# EAGLE board drive itr2 (EAGLE 6.5.0)
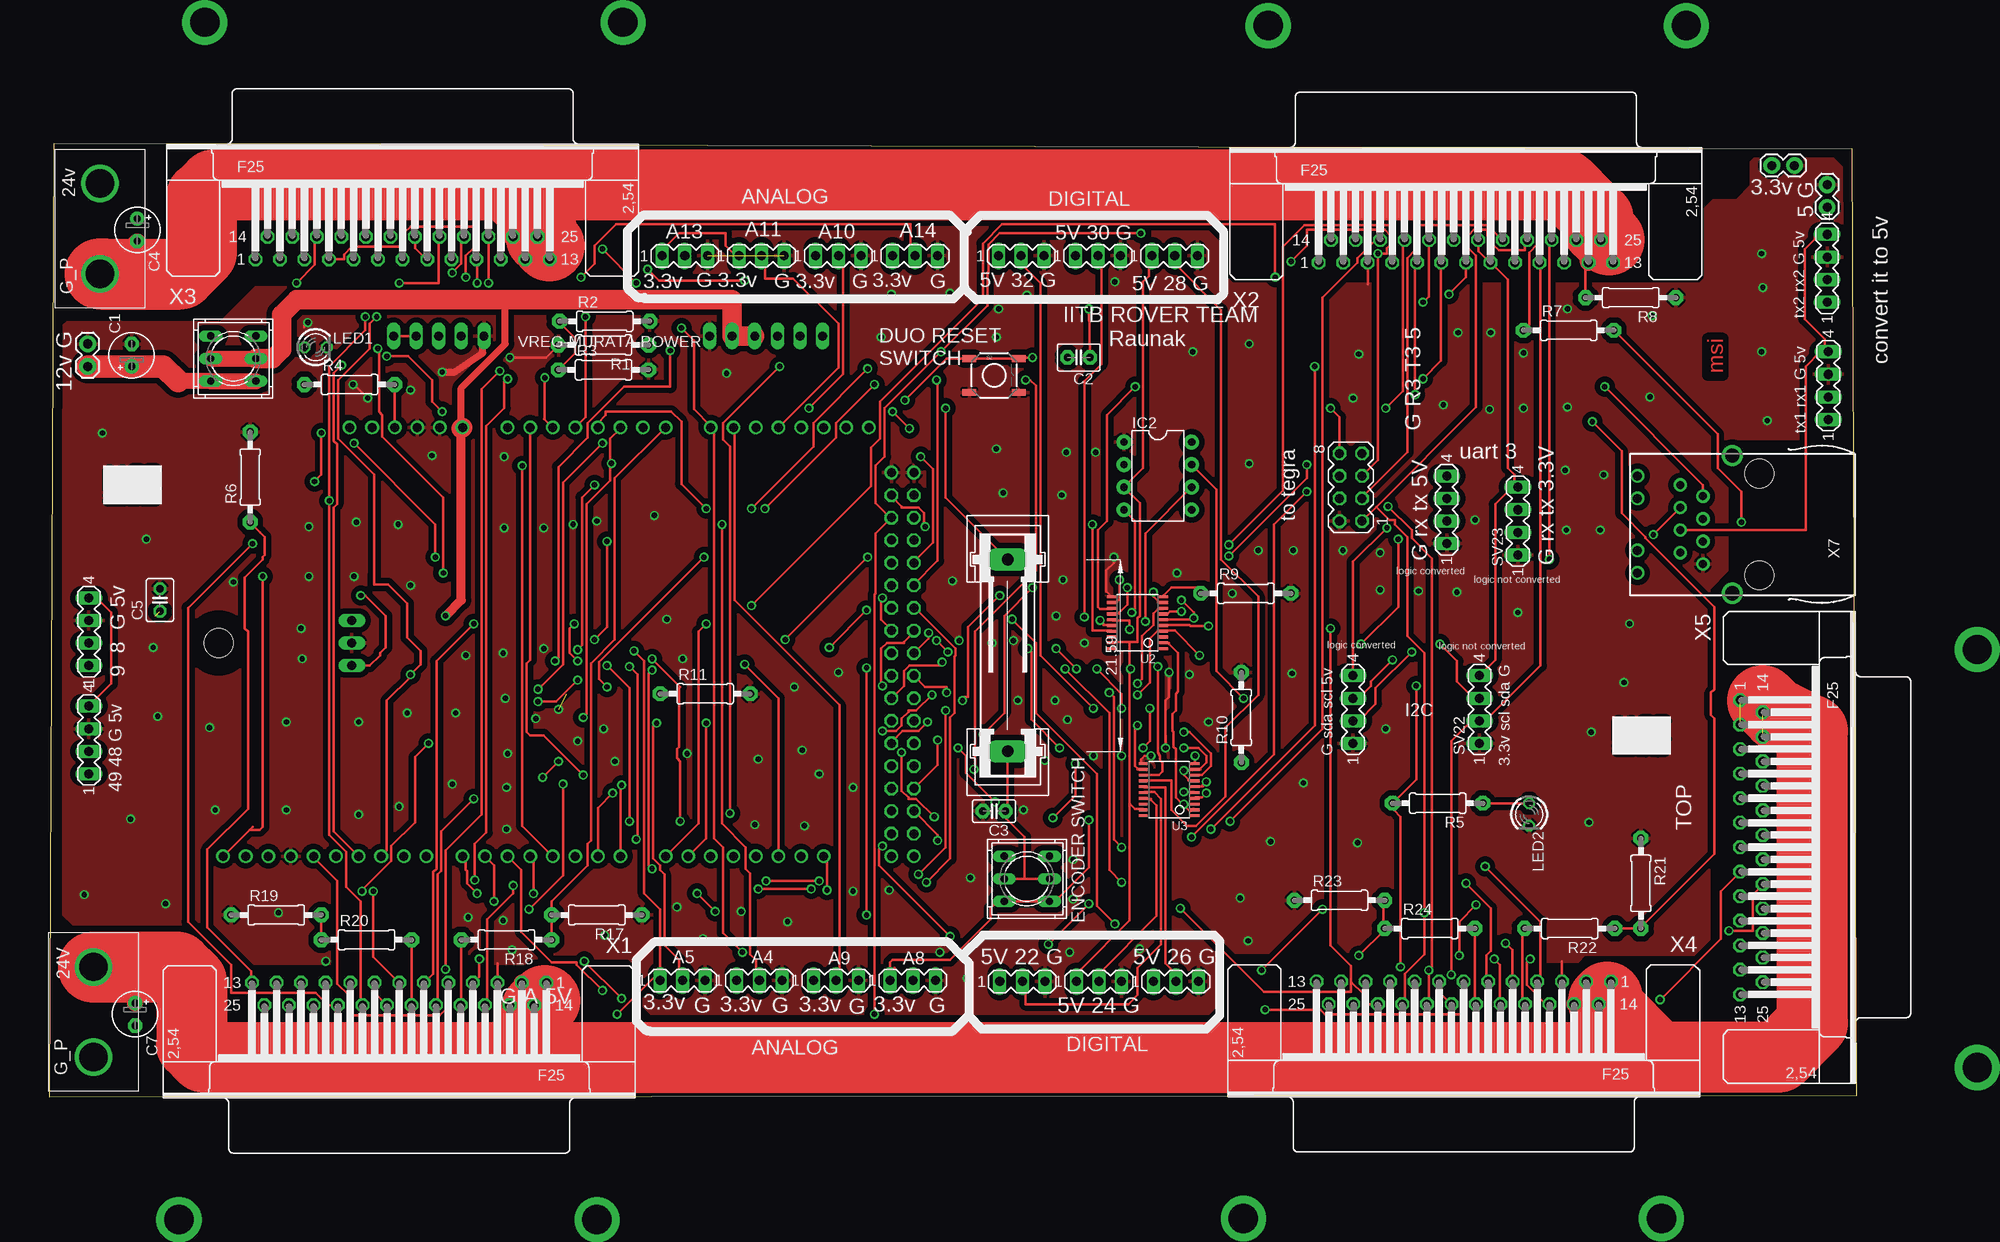
[diagram p2: board, top side]
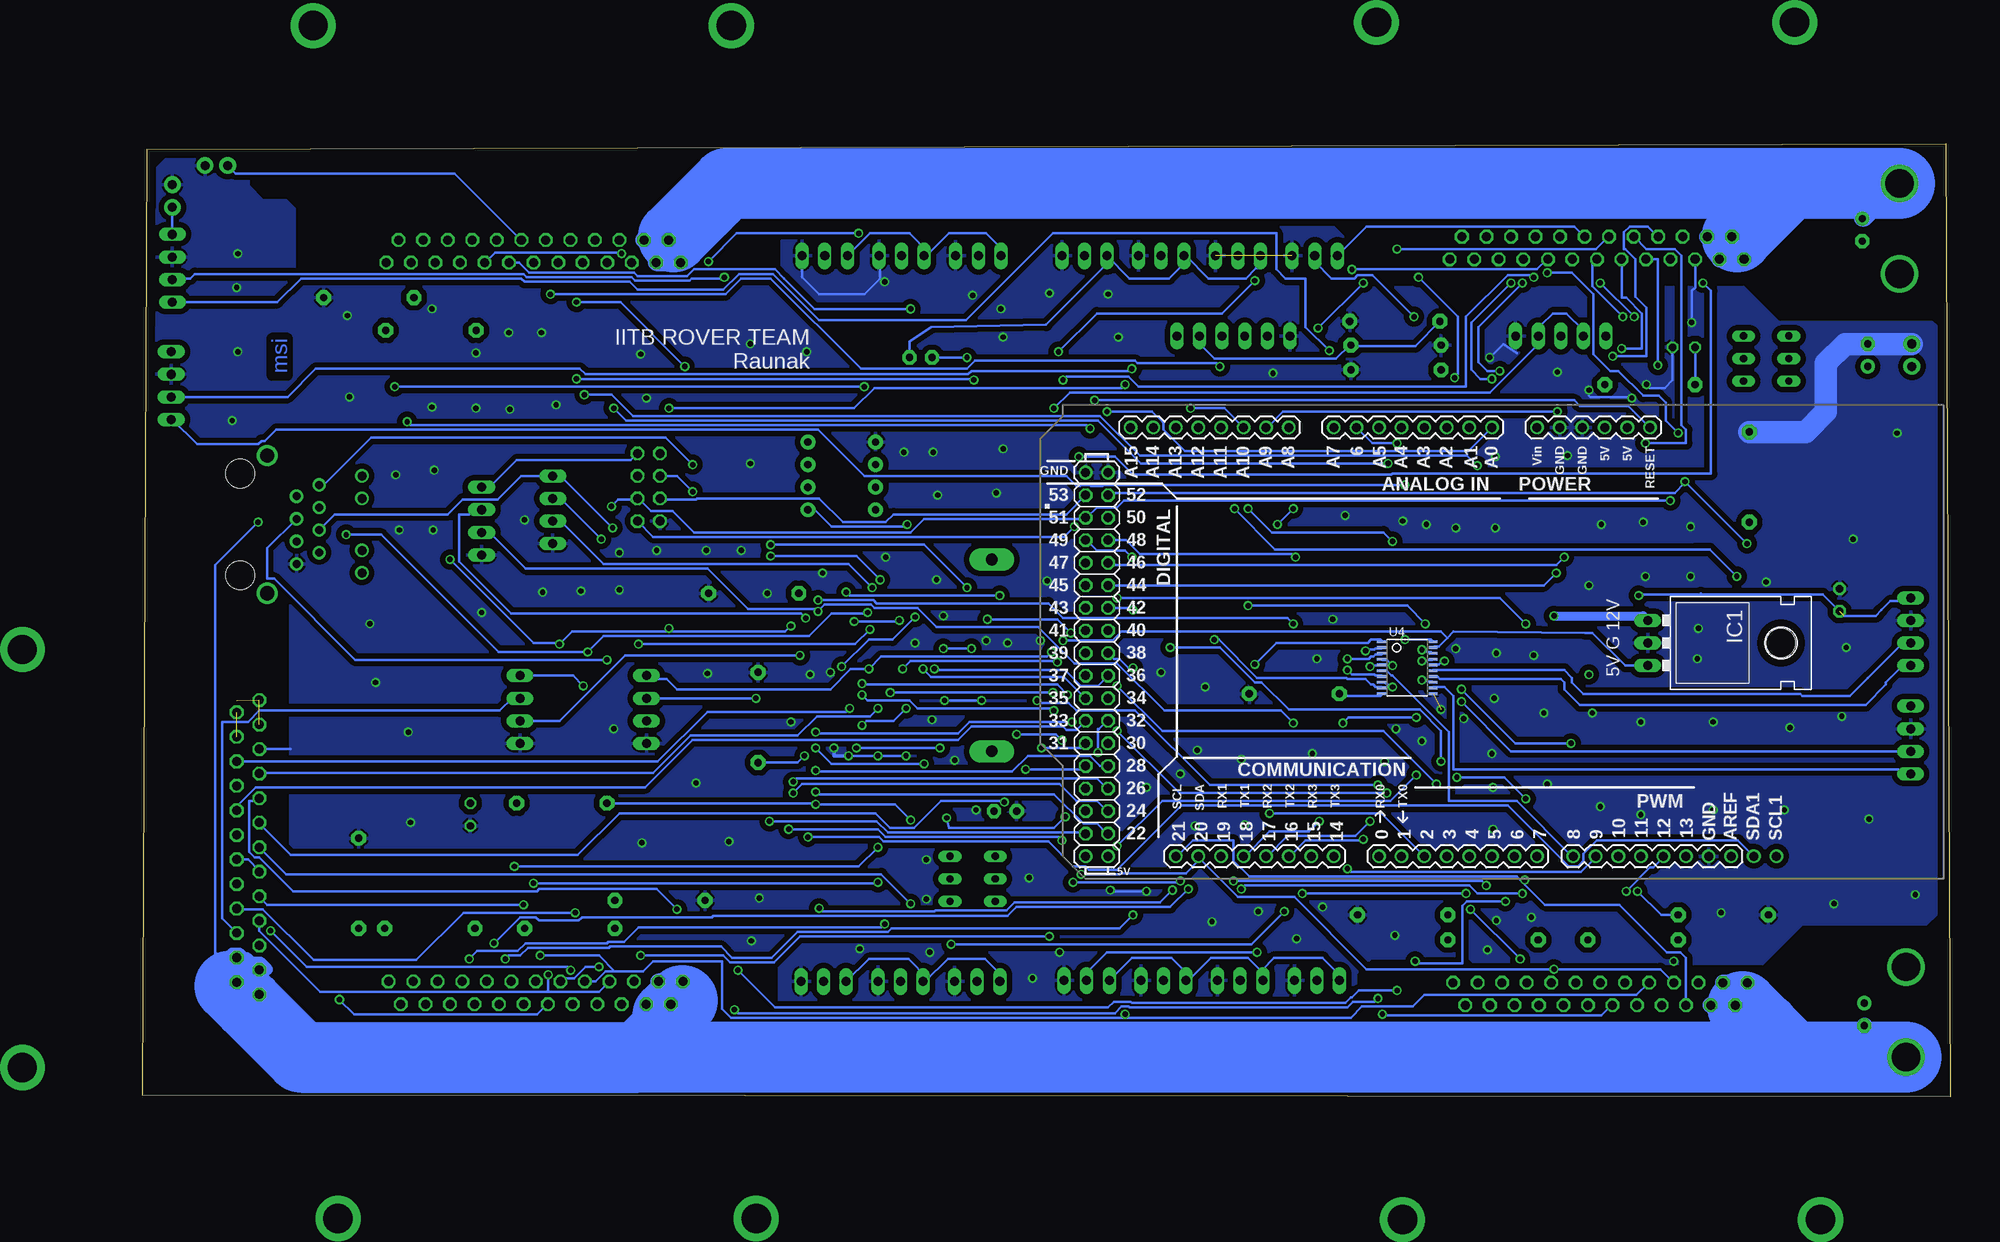
[diagram p3: board, bottom side, seen from below]

Size 203.35 x 107.24 mm. Coordinates in mm from the lower left corner, seen from the top.
Outline: 0,0 203.35,0.13 202.84,106.6 0.51,107.24 0,0
Copper layers (1*16): Top 0.035mm / dielectric 1.5mm / Bottom 0.035mm
Design rules "default": minimum track width 10mil, minimum drill 24mil, track to track 8mil, track to pad 8mil, pad to pad 8mil, via to via 8mil, smd to smd 8mil, copper to edge 40mil, drill to drill 8mil, minimum pad ring 10mil, minimum via ring 8mil, stop-mask expansion 4mil, vias tented up to drill 0mil, thermal gap 10mil

## Footprints (pad centres in the part's own frame; a part is rotated, then mirrored left to right if it is on the bottom)
E2,5-5 = drill 0.813 pad 1.6: + -1.27,0 | drill 0.813 pad 1.6 octagon: - 1.27,0
C2.5-3 = drill 0.813 pad 1.6 octagon: 1 -1.27,0; 2 1.27,0
C2.5-2 = drill 0.813 pad 1.6 octagon: 1 -1.27,0; 2 1.27,0
C025-030X050 = drill 0.813 pad 1.422 octagon: 1 -1.27,0; 2 1.27,0
GSH15 = drill 1.321 pad 2.54 long: 1 -7.62,0; 2 13.97,0
TO-220-ALT = drill 1.016 long: GND 0,-3.81; IN -2.54,-3.81; OUT 2.54,-3.81 | hole 3.302: 0,11.176
DIL08-ROUND = drill 0.813 pad 1.676: 1 -3.81,-3.81; 2 -1.27,-3.81; 3 1.27,-3.81; 4 3.81,-3.81; 5 3.81,3.81; 6 1.27,3.81; 7 -1.27,3.81; 8 -3.81,3.81
1X02 = drill 1.016 pad 1.88: 1 0,0; 2 2.54,0
LED3MM = drill 0.813 octagon: A -1.27,0; K 1.27,0
0207/10 = drill 0.813 pad 1.676 octagon: 1 -5.08,0; 2 5.08,0
TACTILE-SWITCH-SMD = smd 1.524 x 0.762: 1 -2.794,1.905; 2 2.794,1.905; 3 -2.794,-1.905; 4 2.794,-1.905
9077-2 = drill 0.813 long: 1 -2.54,2.54; 2 0,2.54; 3 2.54,2.54; 4 -2.54,-2.54; 5 0,-2.54; 6 2.54,-2.54
MA04-1 = drill 1.016 long: 1 -3.81,0; 2 -1.27,0; 3 1.27,0; 4 3.81,0
MA03-1 = drill 1.016 long: 1 -2.54,0; 2 0,0; 3 2.54,0
MA04-2 = drill 1.016 octagon: 1 -3.81,-1.27; 2 -3.81,1.27; 3 -1.27,-1.27; 4 -1.27,1.27; 5 1.27,-1.27; 6 1.27,1.27; 7 3.81,-1.27; 8 3.81,1.27
ARDUINO_MEGA = drill 1.016 pad 1.422: 0 63.5,50.8; 1 60.96,50.8; 2 58.42,50.8; 3 55.88,50.8; 3.3V 35.56,2.54; 4 53.34,50.8; 5 50.8,50.8; 5V@0 38.1,2.54; 5V@1 93.98,50.8; 5V@2 96.52,50.8; 6 48.26,50.8; 7 45.72,50.8; 8 41.656,50.8; 9 39.116,50.8; 10 36.576,50.8; 11 34.036,50.8; 12 31.496,50.8; 13 28.956,50.8; 14 68.58,50.8; 15 71.12,50.8; 16 73.66,50.8; 17 76.2,50.8; 18 78.74,50.8; 19 81.28,50.8; 20 83.82,50.8; 21 86.36,50.8; A0 50.8,2.54; A1 53.34,2.54; A2 55.88,2.54; A3 58.42,2.54; A4 60.96,2.54; A5 63.5,2.54; A6 66.04,2.54; A7 68.58,2.54; A8 73.66,2.54; A9 76.2,2.54; A10 78.74,2.54; A11 81.28,2.54; A12 83.82,2.54; A13 86.36,2.54; A14 88.9,2.54; A15 91.44,2.54; AREF 23.876,50.8; GND@0 40.64,2.54; GND@1 43.18,2.54; GND@2 93.98,7.62; GND@3 96.52,7.62; GND@4 26.416,50.8; RESET 33.02,2.54; SCL1 18.796,50.8; SDA1 21.336,50.8; VIN 45.72,2.54 | drill 1.016 pad 1.422 octagon: 22 93.98,48.26; 23 96.52,48.26; 24 93.98,45.72; 25 96.52,45.72; 26 93.98,43.18; 27 96.52,43.18; 28 93.98,40.64; 29 96.52,40.64; 30 93.98,38.1; 31 96.52,38.1; 32 93.98,35.56; 33 96.52,35.56; 34 93.98,33.02; 35 96.52,33.02; 36 93.98,30.48; 37 96.52,30.48; 38 93.98,27.94; 39 96.52,27.94; 40 93.98,25.4; 41 96.52,25.4; 42 93.98,22.86; 43 96.52,22.86; 44 93.98,20.32; 45 96.52,20.32; 46 93.98,17.78; 47 96.52,17.78; 48 93.98,15.24; 49 96.52,15.24; 50 93.98,12.7; 51 96.52,12.7; 52 93.98,10.16; 53 96.52,10.16
TSSOP20 = smd 0.305 x 0.991: 1 -2.925,-2.918; 2 -2.275,-2.918; 3 -1.625,-2.918; 4 -0.975,-2.918; 5 -0.325,-2.918; 6 0.325,-2.918; 7 0.975,-2.918; 8 1.625,-2.918; 9 2.275,-2.918; 10 2.925,-2.918; 11 2.925,2.918; 12 2.275,2.918; 13 1.625,2.918; 14 0.975,2.918; 15 0.325,2.918; 16 -0.325,2.918; 17 -0.975,2.918; 18 -1.625,2.918; 19 -2.275,2.918; 20 -2.925,2.918
VREG = drill 1 long: P$1 0,0; P$2 2.54,0; P$3 5.08,0; P$4 7.62,0; P$5 10.16,0; P$6 35.56,0; P$7 38.1,0; P$8 40.64,0; P$9 43.18,0; P$10 45.72,0; P$11 48.26,0
POW_HOLE = drill 3.2: P$1 0,0; P$2 10.16,0
F25HP = drill 1.016 octagon: 1 -16.561,-1.27; 2 -13.792,-1.27; 3 -11.049,-1.27; 4 -8.28,-1.27; 5 -5.512,-1.27; 6 -2.769,-1.27; 7 0,-1.27; 8 2.769,-1.27; 9 5.512,-1.27; 10 8.28,-1.27; 11 11.049,-1.27; 12 13.792,-1.27; 13 16.561,-1.27; 14 -15.189,1.27; 15 -12.421,1.27; 16 -9.652,1.27; 17 -6.909,1.27; 18 -4.14,1.27; 19 -1.372,1.27; 20 1.372,1.27; 21 4.14,1.27; 22 6.909,1.27; 23 9.652,1.27; 24 12.421,1.27; 25 15.189,1.27 | drill 3.302 pad 5.08: G1 -22.25,25.4; G2 24.79,25.4
SI-50170 = drill 0.9 pad 1.5: 1 4.445,5.842; 2 3.175,3.302; 3 1.905,5.842; 4 0.635,3.302; 5 -0.635,5.842; 6 -1.905,3.302; 7 -3.175,5.842; 8 -4.445,3.302 | drill 1.016 pad 1.5: A1 -5.461,10.668; A2 2.921,10.668; C1 -2.921,10.668; C2 5.461,10.668 | drill 1.6 pad 2.2: S1 -7.747,0; S2 7.747,0 | hole 3.251: -5.715,-3.048; 5.715,-3.048

## Placement (x,y rotation side)
C1  [E2,5-5]  9.27,83.44 90 top
C2  [C2.5-3]  115.82,83.19 180 top
C3  [C2.5-2]  106.3,32.13 180 top
C4  [E2,5-5]  9.91,97.54 270 top
C5  [C025-030X050]  12.45,55.88 90 top
C7  [E2,5-5]  9.65,9.27 270 top
F3  FUSEGSH15  [GSH15]  107.82,46.48 90 top
IC1  [TO-220-ALT]  30.23,51.05 270 bottom
IC2  NE555N  [DIL08-ROUND]  124.71,69.85 270 top
JP1  M02PTH  [1X02]  4.32,82.17 90 top
JP2  M02PTH  [1X02]  193.8,104.78 0 top
JP3  M02PTH  [1X02]  200.02,100.08 90 top
LED1  [LED3MM]  29.97,84.33 0 top
LED2  [LED3MM]  166.5,31.75 270 top
R1  [0207/10]  62.36,84.58 180 top
R2  [0207/10]  62.48,87.25 0 top
R3  [0207/10]  62.36,81.79 0 top
R4  [0207/10]  33.78,80.14 0 top
R5  [0207/10]  156.21,33.02 180 top
R6  [0207/10]  22.61,69.72 90 top
R7  [0207/10]  170.94,86.23 0 top
R8  [0207/10]  177.93,89.92 180 top
R9  [0207/10]  134.62,56.64 0 top
R10  [0207/10]  134.11,42.67 90 top
R11  [0207/10]  73.79,45.34 0 top
R17  [0207/10]  61.59,20.45 180 top
R18  [0207/10]  51.43,17.65 180 top
R19  [0207/10]  25.53,20.45 0 top
R20  [0207/10]  35.69,17.65 0 top
R21  [0207/10]  179.07,24 270 top
R22  [0207/10]  171.07,18.92 180 top
R23  [0207/10]  145.16,22.1 0 top
R24  [0207/10]  155.32,18.92 0 top
S2  [TACTILE-SWITCH-SMD]  106.3,81.15 0 top
S5  9077-2  [9077-2]  109.98,24.51 90 top
S6  9077-2  [9077-2]  20.7,83.06 90 top
SV1  [MA04-1]  157.23,66.04 90 top
SV2  [MA03-1]  71.5,94.61 0 top
SV3  [MA03-1]  97.41,94.61 0 top
SV4  [MA03-1]  109.35,94.61 0 top
SV5  [MA03-1]  117.98,94.61 0 top
SV6  [MA03-1]  126.62,94.61 0 top
SV7  [MA03-1]  126.75,12.95 0 top
SV8  [MA03-1]  109.47,12.95 0 top
SV9  [MA03-1]  118.11,12.95 0 top
SV10  [MA04-1]  200.02,93.22 90 top
SV11  [MA04-1]  200.15,80.01 90 top
SV12  [MA04-1]  4.45,52.32 90 top
SV13  [MA03-1]  80.14,94.61 0 top
SV14  [MA04-1]  146.69,43.56 90 top
SV15  [MA04-1]  4.45,40.13 90 top
SV16  [MA04-2]  146.43,68.58 90 top
SV17  [MA03-1]  71.25,13.08 0 top
SV18  [MA03-1]  79.88,13.08 0 top
SV19  [MA03-1]  88.77,94.61 0 top
SV20  [MA03-1]  88.52,13.08 0 top
SV21  [MA03-1]  97.16,13.08 0 top
SV22  [MA04-1]  160.91,43.56 90 top
SV23  [MA04-1]  165.23,64.77 90 top
U1  ARDUINO-MEGAFULL  [ARDUINO_MEGA]  0.76,77.85 180 bottom
U2  [TSSOP20]  122.43,53.34 90 top
U3  [TSSOP20]  125.98,34.54 90 top
U4  [TSSOP20]  61.09,48.26 270 bottom
U$1  [MSI]  175.89,39.12 0 top
U$2  [MSI]  6.1,67.31 0 top
U$7  VREG-MURATA  [VREG]  38.73,85.6 0 top
U$8  POW_HOLE  [POW_HOLE]  4.95,4.45 90 top
U$9  POW_HOLE  [POW_HOLE]  5.71,92.58 90 top
X1  [F25HP]  39.37,11.56 180 top
X2  [F25HP]  159.38,95.12 0 top
X3  [F25HP]  39.75,95.5 0 top
X4  [F25HP]  159.13,11.68 180 top
X5  [F25HP]  191.52,28.07 270 top
X7  SI-50170  [SI-50170]  189.36,64.39 90 top

## Tracks (layer width: path | path; a pad name or v marks a point on that pad's centre or on a via)
1DB1  (via drill 0.61)
  Top 0.254: U1.27 99.95,37.34 v99.95,40.13 | v105.03,40.77 107.44,43.18 107.44,54.1 v110.62,57.28 | v132.72,62.1 138.81,68.2 138.81,95.63 141.22,98.04 151.38,98.04 151.38,94.11 151.13,93.85 X2.4
  Bottom 0.254: v99.95,40.13 100.58,40.77 v105.03,40.77 | v110.62,57.28 115.44,62.1 v132.72,62.1
1DB2  (via drill 0.61)
  Top 0.254: v132.84,30.99 143.26,41.4 143.26,89.92 147.19,93.85 147.19,94.36 149.22,96.39 X2.16
  Bottom 0.254: U1.23 97.41,29.72 119.51,29.72 120.78,30.99 v132.84,30.99
1DT1  (via drill 0.61)
  Top 0.254: v104.01,36.83 104.14,36.96 104.14,52.32 111,59.18 111,80.01 110.36,80.64 v109.86,80.64 | v154.56,80.77 156.59,82.8 156.59,93.85 X2.6
  Bottom 0.254: U1.29 97.66,36.83 v104.01,36.83 | v109.86,80.64 109.98,80.77 v154.56,80.77
1DT2  (via drill 0.61)
  Top 0.254: U1.25 99.95,29.46 v99.95,28.83 | v130.68,30.1 142.37,41.78 v142.37,82.17 | v154.56,89.41 155.19,90.04 155.19,96.39 X2.18
  Bottom 0.254: v99.95,28.83 100.33,29.21 119.76,29.21 120.65,30.1 v130.68,30.1 | v142.37,82.17 149.61,89.41 v154.56,89.41
3DB1  (via drill 0.61)
  Top 0.254: X3.4 33.15,94.23 33.15,94.74 34.04,95.63 40,95.63 40,97.28 40.64,97.92 47.75,97.92 47.75,95.5 46.86,94.61 v46.86,92.2 | v99.82,80.64 99.95,80.52 99.95,60.33 97.28,57.66 U1.45
  Bottom 0.254: v46.86,92.2 47.12,92.46 49.78,92.46 54.48,87.76 54.48,79.88 91.31,79.88 92.46,81.03 99.44,81.03 v99.82,80.64
3DB2  (via drill 0.61)
  Top 0.254: X3.16 29.85,96.52 29.85,93.6 v27.81,91.57 | v98.04,72.01 99.44,70.61 99.44,62.36 97.28,60.2 U1.47
  Bottom 0.254: v27.81,91.57 26.92,90.68 26.92,70.1 62.74,70.1 62.86,69.98 91.95,69.98 93.98,72.01 v98.04,72.01
3DT1  (via drill 0.61)
  Top 0.254: v36.96,84.2 37.08,84.07 37.08,77.09 37.46,76.71 37.46,74.3 44.32,67.44 v44.32,58.93
  Bottom 0.254: v36.96,84.2 34.67,84.2 34.67,88.14 36.45,89.92 36.96,89.92 36.96,94.23 X3.6 | v44.32,58.93 45.72,57.53 U1.44
3DT2  (via drill 0.61)
  Top 0.254: v34.29,73.53 43.43,64.39 v43.43,60.71
  Bottom 0.254: v34.29,73.53 29.72,73.53 29.72,75.06 30.23,75.56 30.23,94.61 30.99,95.38 34.16,95.38 35.56,96.77 X3.18 | v43.43,60.71 44.32,59.82 94.49,59.82 U1.46
4DB1  (via drill 0.61)
  Top 0.254: v48.39,15.49 48.39,13.46 47.75,12.83 X1.4 | v53.97,21.08 57.78,24.89 v57.78,35.18 | v93.73,46.23 93.6,46.35 93.6,50.42 94.23,51.05 96.14,51.05 96.14,51.18 97.28,52.32 U1.41
  Bottom 0.254: v53.97,21.08 v48.39,15.49 | v57.78,35.18 63.75,41.15 88.65,41.15 v93.73,46.23
4DB2  (via drill 0.61)
  Top 0.254: X1.16 49.28,10.54 49.28,19.94 52.2,22.86 v52.2,23.75 | v86.61,24.26 v80.65,24.26 | v98.68,24.13 101.35,26.8 101.35,42.67 101.85,43.18 101.85,49.53 101.98,49.66 101.98,50.42 97.41,54.99 U1.43
  Bottom 0.254: v52.2,23.75 52.7,24.26 v80.65,24.26 | v86.61,24.26 86.74,24.13 v98.68,24.13
4DT1  (via drill 0.61)
  Top 0.254: v47.75,53.21 43.56,49.02 43.56,25.65 43.18,25.27 43.18,13.84 42.16,12.83 X1.6 | v93.73,56.13 93.6,56.01 93.6,53.72 94.74,52.58 U1.40
  Bottom 0.254: v47.75,53.21 50.67,56.13 v93.73,56.13
4DT2  (via drill 0.61)
  Top 0.254: v47.75,33.53 44.07,29.84 44.07,25.4 43.69,25.02 43.69,10.41 43.56,10.29 X1.18 | v57.28,37.72 v55.5,35.94 | v91.95,54.74 v87.76,50.55
  Bottom 0.254: v47.75,33.53 50.16,35.94 v55.5,35.94 | v57.28,37.72 57.28,41.15 59.69,43.56 74.42,43.56 77.47,46.61 78.23,46.61 82.17,50.55 v87.76,50.55 | v91.95,54.74 92.2,54.99 U1.42
5DB1  (via drill 0.61)
  Top 0.254: U1.37 98.55,46.1 100.97,46.1 v100.97,45.47 | v119.25,45.47 119.76,44.96 119.76,28.96 v120.65,28.07 | v161.54,25.91 167.77,19.68 167.77,13.21 167.51,12.95 X4.4
  Bottom 0.254: v119.25,45.47 v100.97,45.47 | v120.65,28.07 122.81,25.91 v161.54,25.91
5DB2  (via drill 0.61)
  Top 0.254: U1.39 98.93,51.56 v98.93,52.2 | v108.33,53.72 111,51.05 111,43.18 117.86,36.32 117.86,21.46 v119.89,19.43 | v166.62,15.49 166.24,15.11 166.24,12.57 168.4,10.41 X4.16
  Bottom 0.254: v98.93,52.2 100.46,53.72 v108.33,53.72 | v119.89,19.43 120.27,19.05 147.57,19.05 149.22,17.4 151,17.4 151.13,17.27 160.27,17.27 161.16,16.38 165.73,16.38 v166.62,15.49
5DT1  (via drill 0.61)
  Top 0.254: v114.3,48.13 119.25,43.18 119.25,25.53 v120.65,24.13 | v159.38,24 162.18,21.21 162.18,16.38 161.67,15.88 161.67,13.08 161.8,12.95 X4.6
  Bottom 0.254: U1.36 95.89,46.23 97.79,46.23 99.57,48.01 114.17,48.01 v114.3,48.13 | v120.65,24.13 120.78,24 v159.38,24
5DT2  (via drill 0.61)
  Top 0.254: v91.95,20.45 v91.95,48.26 | v162.56,15.49 163.19,14.86 163.19,10.41 X4.18
  Bottom 0.254: U1.38 94.11,49.28 93.47,49.28 92.46,48.26 v91.95,48.26 | v91.95,20.45 93.47,18.92 119.13,18.92 119.51,18.54 129.67,18.54 132.59,15.62 137.03,15.62 138.3,16.89 150.75,16.89 150.88,16.76 160.02,16.76 160.91,15.88 162.18,15.88 v162.56,15.49
5V_NEW  (via drill 0.6, 0.61)  (1 unrouted)
  Top 0.254: SV15.4 6.99,46.48 6.99,54.48 5.33,56.13 SV12.4 | X7.5 197.61,63.75 197.61,82.17 199.26,83.82 199.77,83.82 | SV10.4 198.63,97.03 198.63,96.52 197.48,95.38 197.48,87.5 199.77,85.22 199.77,83.82 | 199.77,83.82 SV11.4 | SV14.4 146.69,60.2 v150.49,64.01 | 121.54,51.18 122.43,51.18 122.43,53.85 122.68,54.1 122.68,66.8 121.03,68.45 121.03,68.58 | 121.54,51.18 119.63,51.18 U2.19 | 121.6,32.96 121.54,33.02 121.54,48.13 | 121.6,32.96 122.17,32.38 123.06,32.38 U3.19 | 121.54,51.18 121.54,48.13 | SV9.1 116.08,13.46 116.08,14.35 121.54,19.81 121.54,32.89 121.6,32.96 | SV6.1 123.7,94.23 123.7,92.33 123.06,91.69 123.06,70.74 121.03,68.71 121.03,68.58 | 121.54,48.13 v121.67,48.13 | v101.09,50.04 v99.82,51.31 | 121.03,68.58 IC2.3
  Top 0.305: v35.05,56.39 35.56,56.39 37.85,54.1 37.85,50.55 37.21,49.91 37.21,49.66 36.07,48.51 IC1.OUT
  Bottom 0.254: 56.58,51.63 55.88,52.32 41.02,52.2 | 56.58,51.63 57.53,50.67 58.04,50.67 58.17,50.55 U4.19 | SV12.4 4.83,55.75 6.73,55.75 7.75,54.74 | JP3.1 SV10.4 | v150.49,64.01 156.34,69.85 SV1.4 160.78,69.85 163.45,67.18 167.39,67.18 169.04,65.53 181.74,65.53 X7.5 | SV4.1 106.81,95.89 107.19,95.89 108.46,97.16 112.65,97.16 115.19,94.61 SV5.1 114.94,95 117.09,97.16 121.54,97.16 SV6.1 | SV8.1 106.93,14.22 107.31,14.22 108.59,15.49 112.78,15.49 115.32,12.95 SV9.1 115.06,13.34 117.22,15.49 121.67,15.49 SV7.1 | SV14.4 146.3,46.99 144.4,46.99 143.26,45.85 125.98,45.85 123.7,48.13 v121.67,48.13 120.27,49.53 101.6,49.53 v101.09,50.04 | 56.58,51.63 57.28,52.32 93.22,52.32 94.23,51.31 v99.82,51.31
  Bottom 0.305: 7.75,54.74 8.38,54.1 11.94,54.1 14.35,56.52 27.94,56.52 | 27.94,56.52 28.07,56.64 | 41.02,52.2 40.26,52.2 36.58,48.51 IC1.OUT | 27.94,56.52 34.92,56.52 v35.05,56.39
6DB1  (via drill 0.61)
  Top 0.254: U1.34 96.14,46.23 96.14,47.88 96.77,48.51 100.46,48.51 v100.46,48.9 | v117.86,48.13 120.65,45.34 v120.65,43.69
  Bottom 0.254: v100.46,48.9 100.58,49.02 116.97,49.02 v117.86,48.13 | v120.65,43.69 121.54,42.8 127.51,42.8 129.67,40.64 141.73,40.64 145.92,36.45 190.25,36.45 X5.4
6DB2  (via drill 0.61)
  Top 0.254: v113.28,50.42 v115.57,48.13 | v110.11,50.42 110.49,50.04 110.49,42.42 v113.67,39.24 | v123.06,39.24 123.83,40.01 v123.83,43.69
  Bottom 0.254: U1.35 99.7,47.24 114.68,47.24 v115.57,48.13 | v110.11,50.42 v113.28,50.42 | v123.06,39.24 v113.67,39.24 | v123.83,43.69 124.21,43.31 139.83,43.31 145.41,37.72 X5.16
6DT1  (via drill 0.61)
  Top 0.254: v102.23,39.24 103.12,38.35 103.12,36.45 v106.43,33.15
  Bottom 0.254: U1.31 97.79,39.24 v102.23,39.24 | v106.43,33.15 106.55,33.27 113.54,33.27 116.59,30.23 119.25,30.23 120.9,31.88 149.73,31.88 154.43,27.18 186.69,27.18 190.25,30.73 X5.6
6DT2
  Bottom 0.254: U1.33 98.3,41.27 99.44,41.27 99.82,41.66 110.11,41.66 111.63,40.13 141.48,40.13 146.81,34.8 190.63,34.8 192.79,32.64 X5.18
12V
  Top 1.778: S6.4 S6.1 14.48,80.52
  Top 2.54: JP1.1 C1.+ 12.83,82.17 14.48,80.52
24V_A
  Bottom 0.254: 142.88,93.85 143.64,96.77
  Bottom 1.778: 23.11,94.23 X3.1 X3.2 25.96,95.4 X3.15 X3.14 24,96.77 | C4.+ 9.65,98.81 U$9.P$2
  Bottom 1.93: 143.64,96.77 146.58,96.77 X2.15 | X2.2 142.88,93.85 X2.1 142.82,95.02 X2.14
  Bottom 8: 143.64,96.77 137.67,102.74 U$9.P$2 18.03,102.74 24,96.77
24V_B  (3 unrouted)
  Top 0.254: X5.14 192.79,43.31 194.94,42.8 | 53.34,6.1 54.86,9.53 X1.14
  Top 1.778: X4.15 X4.14 | X4.14 174.5,10.41 174.94,10.86 | X4.2 175.01,12.95 175.51,12.45 175.51,12.78 X4.1 175.69,11.79 X4.14 | X1.2 X1.1 54.86,11.76 54.86,9.91 | X1.14 X1.15 | C7.+ 9.65,13.59 8.64,14.61
  Top 8: U$8.P$2 8.64,14.61 14.35,14.61 16,12.95 16,5.84 17.4,4.45 51.69,4.45 | 51.69,4.45 180.97,4.45 | 192.79,44.58 194.44,42.93 194.94,42.8 198.37,41.15 198.37,8.26 194.56,4.45 180.97,4.45 | 51.69,4.45 53.34,6.1 53.34,6.35 54.86,7.87 54.86,9.53 54.86,9.91 55.75,10.79 | 180.97,4.45 174.88,10.54 174.88,10.79 174.94,10.86 175.26,11.18
AB1  (via drill 0.61)
  Top 0.254: SV17.2 70.87,13.46 70.87,15.37 69.22,17.02 69.22,25.02 68.71,25.53 68.71,26.04 67.95,26.8 67.95,41.66 v68.33,42.04 | v60.07,42.67 60.45,43.05 60.45,66.67 63.12,69.34 63.12,71.25 | 63.12,71.25 63.12,74.04 64.26,75.18 U1.A5 | v150.37,77.47 152.27,79.38 152.27,96.27 152.4,96.39 X2.17 | 63.12,71.25 v63.25,71.25
  Bottom 0.254: v68.33,42.04 67.69,42.67 v60.07,42.67 | v150.37,77.47 148.97,76.07 95.89,76.07 91.06,71.25 v63.25,71.25
AB2  (via drill 0.61)
  Top 0.254: v85.47,77.47 89.28,81.28 89.28,93.22 88.77,93.73 SV19.2
  Bottom 0.254: U1.A10 81.66,77.47 v85.47,77.47
AB3  (via drill 0.61)
  Top 0.254: SV20.2 88.9,13.46 88.9,44.07 77.09,55.88 77.09,74.55 76.96,74.68 U1.A9
  Top 0.305: v37.97,83.31 40.39,83.31 43.05,80.64 43.05,78.23 v44.2,77.09
  Bottom 0.254: v37.97,83.31 34.16,83.31 34.16,88.77 35.43,90.04 35.43,94.23 36.58,95.38 36.7,95.38 36.7,97.28 36.07,97.92 34.04,97.92 32.89,96.77 X3.17 | v44.2,77.09 75.06,77.09 76.84,75.31 U1.A9
AB4
  Top 0.254: U1.A7 63.63,69.6 63.63,51.44 60.96,48.77 60.96,28.83 60.58,28.45 60.58,26.04 56.52,21.97 R17.2 R18.1
AB5  (via drill 0.61)
  Top 0.254: v96.77,75.18 v94.87,77.09 | v173.61,75.95 176.91,72.64 176.91,65.66 179.58,62.99 179.58,62.87 187.32,55.12 187.32,45.85 186.94,45.47 186.94,42.93 187.32,42.55 187.32,27.3 179.07,19.05 R21.2 R22.1
  Bottom 0.254: U1.A0 54.23,72.64 86.11,72.64 88.52,75.06 88.52,75.95 88.65,75.95 89.79,77.09 v94.87,77.09 | v96.77,75.18 97.16,75.56 173.23,75.56 v173.61,75.95
AB6  (via drill 0.6, 0.61)
  Top 0.254: U1.A2 55.69,76.26 55.75,76.33 v55.75,80.9 | v59.82,92.2 61.34,93.73 61.34,95.76 63.75,98.17 96.9,98.17 96.9,96.01 97.41,95.5 SV3.2
  Bottom 0.254: v59.82,92.2 55.37,87.76 55.37,81.28 v55.75,80.9
AT1  (via drill 0.61)
  Top 0.254: SV18.2 79.5,13.46 79.5,15.37 78.87,16 78.87,25.15 78.36,25.65 78.36,28.07 75.69,30.73 v75.69,64.39 | v73.91,66.17 71.12,68.96 71.12,75.95 69.98,77.09 62.61,77.09 62.61,76.71 61.72,75.82 U1.A4
  Bottom 0.254: v73.91,66.17 v75.69,64.39
AT3  (via drill 0.61)
  Top 0.254: v77.98,16.26 75.82,18.41 75.82,28.07 74.8,29.08 74.8,74.55 74.42,74.93 U1.A8 74.42,75.44 72.52,77.34 72.52,85.09 v71.12,86.49 | v66.04,91.57 v62.23,95.38
  Bottom 0.254: SV21.2 97.16,14.35 96.77,14.35 94.87,16.26 v77.98,16.26 | v62.23,95.38 39.88,95.38 38.48,96.77 X3.19 | v71.12,86.49 v66.04,91.57
AT4  (via drill 0.61)
  Top 0.254: v62.23,73.53 57.78,69.09 57.78,48.64 v54.99,45.85 | v42.67,39.75 41.15,38.23 41.15,30.86 38.48,28.19 38.48,26.54 35.18,23.24 v35.18,23.11 | R19.2 R20.1
  Bottom 0.254: U1.A6 65.02,73.53 v62.23,73.53 | v54.99,45.85 48.89,39.75 v42.67,39.75 | v35.18,23.11 32.51,20.45 R19.2
AT5  (via drill 0.61)
  Top 0.254: v93.73,28.19 93.34,27.81 93.34,26.04 v101.35,18.03 | v147.32,15.88 150.24,18.8 R24.1 150.11,18.8 150.11,21.97 R23.2
  Top 0.305: v60.07,36.2 55.63,40.64 54.1,40.64 53.72,41.02 53.72,48.77 54.1,49.15 U1.A1
  Bottom 0.254: v60.07,36.2 62.99,33.27 88.65,33.27 v93.73,28.19 | v101.35,18.03 129.41,18.03 132.33,15.11 137.29,15.11 138.05,15.88 v147.32,15.88
AT6  (via drill 0.61)
  Top 0.254: U1.A3 60.32,76.45 v60.32,87.76
  Bottom 0.254: v60.32,87.76 65.02,92.46 66.68,92.46 67.06,92.08 69.6,92.08 71.5,93.98 SV2.2
CONN
  Top 0.254: S5.5 109.73,24.51 | 109.73,24.51 S5.2 | F3.1 107.82,32.38 C3.1 107.7,32.13 107.7,31.24 109.73,29.21 109.73,24.51
CUR_SENS
  Top 0.254: U1.A11 88.77,82.04 88.77,87 83.69,92.08 80.52,92.08 80.52,94.23 SV13.2
D48  (via drill 0.61)
  Top 0.254: v62.74,46.1 61.85,46.99 61.85,48.9 v73.66,60.71
  Bottom 0.254: v62.74,46.1 62.86,46.23 63.12,46.23 63.37,46.48 63.5,46.48 63.63,46.61 63.88,46.61 U4.8 | v73.66,60.71 74.04,61.09 91.19,61.09 92.71,62.61 U1.48
D48_5V  (via drill 0.61)
  Top 0.254: v59.44,46.86 57.02,44.45 v54.99,44.45
  Bottom 0.254: v59.44,46.86 58.93,46.86 58.8,46.74 58.29,46.74 U4.13 | v54.99,44.45 49.4,38.86 SV15.2
D49  (via drill 0.61)
  Top 0.254: v92.08,60.71 v82.8,51.44
  Bottom 0.254: v82.8,51.44 82.3,51.44 77.98,47.12 67.95,47.12 67.82,46.99 65.79,46.99 65.15,46.35 64.9,46.35 64.64,46.1 64.01,46.1 U4.9 | v92.08,60.71 92.84,61.47 96.01,61.47 97.16,62.61 U1.49
D49_5V
  Bottom 0.254: SV15.1 5.33,36.32 5.84,36.83 55.88,36.83 55.88,45.09 56.9,46.1 58.17,46.1 U4.12
D53
  Bottom 0.254: U1.53 99.44,65.53 118.87,65.53 119.76,64.64 124.59,64.64 127.25,67.31 140.97,67.31 141.1,67.18 145.03,67.18 SV16.4
DE6  (via drill 0.61)
  Top 0.254: v127.64,39.24 129.29,39.24 130.17,38.35 130.17,37.59 129.54,36.96 129.54,36.83 U3.9 | v99.57,31.5 97.54,33.53 96.65,33.53 96.65,33.66 95.89,34.42 v95.89,38.73
  Top 0.305: v112.9,31.37 115.44,33.91 v115.44,37.47
  Bottom 0.254: v127.64,39.24 125.86,37.47 v115.44,37.47 | v112.9,31.37 112.65,30.23 100.84,30.23 v99.57,31.5 | v95.89,38.73 95.89,41.4 95.76,41.4 94.87,42.29 U1.32
DE6_5V  (via drill 0.61)
  Top 0.254: v122.43,41.78 122.17,41.53 122.17,37.21 122.43,36.96 122.43,36.83 U3.12 | v117.48,43.69 111.51,49.66 111.51,91.57 109.35,93.73 SV4.2
  Bottom 0.254: v122.43,41.78 121.92,42.29 118.87,42.29 v117.48,43.69
DE7  (via drill 0.61)
  Top 0.254: v127.64,41.02 128.27,41.02 130.68,38.61 130.68,37.21 129.67,36.2 128.91,36.2 U3.8 | v98.81,42.16 97.79,41.15 96.01,41.15 94.74,39.88 U1.30
  Bottom 0.254: v127.64,41.02 127.51,40.89 111.63,40.89 110.36,42.16 v98.81,42.16
DE7_5V  (via drill 0.61)
  Top 0.254: v124.71,48.39 124.71,38.73 124.97,38.35 124.97,37.85 125.22,37.59 125.22,36.58 124.84,36.2 123.19,36.2 U3.13 | v116.46,53.98 116.46,80.52 118.36,82.42 118.36,93.09 117.98,93.47 SV5.2
  Bottom 0.254: v124.71,48.39 121.67,51.44 119,51.44 v116.46,53.98
DE8  (via drill 0.61)
  Top 0.254: v127.64,36.7 127.64,36.2 128.14,35.69 128.14,35.56 128.78,35.56 U3.7
  Bottom 0.254: v127.64,36.7 127.51,36.58 105.54,36.58 103.76,38.35 96.77,38.35 95.63,37.21 U1.28
DE8_5V
  Top 0.254: SV6.2 126.62,93.73 131.83,88.52 131.83,60.45 136.02,56.26 136.02,45.21 132.33,41.53 132.33,33.78 129.03,30.48 128.02,30.48 126.24,32.26 126.24,35.56 123.19,35.56 U3.14
DE9  (via drill 0.61)
  Top 0.254: v130.17,35.43 129.79,35.05 129.79,34.92 128.91,34.92 U3.6
  Bottom 0.254: v130.17,35.43 129.79,35.81 96.01,35.81 94.87,34.67 U1.26
DE9_5V
  Top 0.254: SV7.2 126.75,13.84 125.6,14.99 125.6,34.8 123.19,34.8 U3.15
DE10  (via drill 0.61)
  Top 0.254: v127.64,34.29 128.78,34.29 U3.5
  Bottom 0.254: v127.64,34.29 127.38,34.04 100.84,34.04 97.54,30.73 96.01,30.73 94.87,29.59 U1.22
DE10_5V
  Top 0.254: SV8.2 109.86,12.57 109.86,10.41 121.41,10.41 122.43,11.43 122.43,14.48 125.09,17.14 125.09,33.53 124.33,34.29 123.19,34.29 U3.16
DE11  (via drill 0.61)
  Top 0.254: v130.17,34.16 129.67,33.66 128.91,33.66 U3.4
  Bottom 0.254: v130.17,34.16 129.16,35.18 100.2,35.18 98.3,33.27 96.01,33.27 94.87,32.13 U1.24
DE11_5V
  Top 0.254: SV9.2 118.11,13.84 124.59,20.32 124.59,32.77 123.95,33.4 123.95,33.53 123.19,33.53 U3.17
ENC  (via drill 0.61)
  Top 0.254: 106.3,21.59 106.3,21.97 S5.1 S5.4 113.67,21.97 113.67,22.48 116.97,25.78 v116.97,31.11 | 95.12,14.48 94.62,13.97 SV21.1 | X1.20 37.97,10.29 36.7,11.56 36.7,12.83 X1.8 | v65.79,50.16 66.93,49.02 66.93,22.86 68.71,21.08 68.71,14.1 | 68.71,14.1 v63.88,9.27 | 68.71,14.1 SV17.1 | X3.8 42.42,94.23 41.15,95.5 41.15,96.77 X3.20 | SV2.1 69.47,95.12 69.47,95.76 70.87,97.16 76.07,97.16 76.07,95.76 77.22,94.61 SV13.1 | X4.20 157.73,10.41 156.46,11.68 156.46,12.95 X4.8 | v181.23,10.92 188.09,17.78 188.09,23.11 190.25,25.27 X5.8 | X2.20 160.78,96.39 160.78,95.12 162.05,93.85 X2.8 162.18,93.85 164.08,91.95 164.08,70.74 164.85,69.98 164.85,68.58 | 127.57,32.83 128.27,32.13 128.4,32.13 128.65,32.38 128.78,32.38 U3.2 | 127.57,32.83 126.75,33.66 126.75,39.12 126.49,39.37 126.49,41.02 126.37,41.15 126.37,43.05 126.75,43.43 126.75,45.34 127,45.59 127,49.91 125.98,50.93 125.98,51.05 125.35,51.05 U2.2 | SV22.4 162.69,49.15 162.69,66.67 164.59,68.58 164.85,68.58 | v153.8,46.23 153.8,35.69 R5.2 151.26,33.02 151.26,32.26 152.02,31.5 v152.02,14.61 | v127.64,32.89 127.57,32.83 | 164.85,68.58 SV23.4 | v116.97,88.65 C2.1
  Top 0.305: 106.3,21.59 105.92,21.21 105.92,19.94 101.35,15.37 94.87,15.37 94.62,15.11 SV21.1
  Bottom 0.254: 77.34,14.35 77.72,14.35 78.99,15.62 83.19,15.62 85.73,13.08 SV20.1 85.47,13.46 87.63,15.62 92.08,15.62 SV21.1 | v65.79,50.16 65.66,50.29 64.77,50.29 64.64,50.42 64.01,50.42 U4.2 | v63.88,9.27 63.75,9.14 39.24,9.14 38.1,10.29 X1.20 | 77.34,14.35 76.07,15.62 70.61,15.62 68.71,13.72 SV17.1 | 77.34,14.35 SV18.1 | SV2.1 65.66,97.92 42.29,97.92 41.15,96.77 X3.20 | SV13.1 77.6,93.22 78.11,93.22 79.25,92.08 83.44,92.08 85.98,94.61 SV19.1 85.73,94.23 87.88,92.08 92.33,92.08 SV3.1 94.49,94.11 101.73,86.87 114.68,86.61 | X5.8 190.25,25.4 191.52,26.67 192.79,26.67 X5.20 | v181.23,10.92 179.58,9.27 159,9.27 157.86,10.41 X4.20 | JP2.1 192.91,103.89 168.27,103.89 160.78,96.39 X2.20 | SV16.7 148.46,71.63 161.29,71.63 164.34,68.58 SV23.4 | v153.8,46.23 154.94,47.37 SV22.4 | R5.2 127.64,33.02 v127.64,32.89 118.75,32.89 v116.97,31.11 | v152.02,14.61 153.54,14.61 154.81,13.34 155.96,13.34 156.34,12.95 X4.8 | 131.19,92.08 132.21,93.09 141.35,93.09 142.11,92.33 147.7,92.33 148.08,92.71 159.89,92.71 161.04,93.85 X2.8
  Bottom 0.305: 114.68,86.61 117.09,84.96 C2.1 | 131.19,92.08 127.76,88.65 v116.97,88.65
GND  (via drill 0.6)  (3 unrouted)
  Top 0.254: 50.42,14.99 X1.3 | 170.18,15.24 X4.3 | 148.34,91.44 X2.3 | v34.16,80.14 34.29,80.14 v35.81,78.61 | 57.02,84.33 R1.2 55.88,83.19 v51.82,83.19
  Top 0.305: U2.11 118.87,56.9 118.87,59.18 119.76,60.07 v119.76,60.71 | v125.6,39.24 125.6,44.58 125.98,44.96 v125.98,47.75 | U3.11 122.81,37.73 122.81,37.97 123.19,38.35 v123.95,38.35 | v29.08,87.12 28.7,86.74 28.7,86.61
  Top 0.813: v44.2,81.53 45.59,81.53 48.77,83.69 48.77,85.47 U$7.P$5
  Bottom 0.254: X3.3 28.7,91.06 | 186.69,39.12 X5.3 | 57.15,84.45 R1.2 | LED1.K 31.24,80.64 32.13,79.76 33.78,79.76 v34.16,80.14 | v35.81,78.61 35.94,78.74 40.51,78.74 40.64,78.87 v40.64,79.5 | 48.77,83.69 50.29,84.71 v51.82,83.19
  Bottom 0.305: v123.95,38.35 v120.65,38.35 v117.48,38.35 | v108.97,44.58 v113.16,44.58 | 28.7,91.06 29.08,90.68 v29.08,87.12 | SV5.3 120.4,94.49 120.4,92.08 122.17,90.3 127.25,90.3 129.16,92.2 SV6.3 | v90.42,23.11 94.36,23.11 v94.49,23.24
  Bottom 0.406: v123.95,38.35 125.6,38.35 v125.6,39.24
  Bottom 2.54: JP1.2 11.81,84.71 13.97,82.55 13.97,77.09 16.26,74.8 R6.2
  other vias: 28.32,52.7 18.03,41.53 18.67,32.26 26.67,32.26 34.8,31.75 34.8,42.16 45.72,43.18 40.26,43.18 45.34,35.18 63.63,37.72 34.29,58.55 29.21,58.55 40.64,57.53 39.24,64.39 34.54,64.64 29.21,64.14 20.7,57.91 5.97,74.68 28.45,49.28 10.92,62.74 51.18,64.01 55.63,64.01 58.93,64.39 61.59,64.77 68.07,65.41 83.82,46.1 88.77,47.75 79.76,37.97 84.71,38.99 86.61,36.32 90.42,34.8 84.96,30.48 79.38,30.61 83.06,19.68 77.85,20.83 73.53,17.78 62.48,18.16 52.07,16.51 103.25,13.34 137.41,28.7 147.19,28.57 173.23,30.86 173.48,41.02 177.16,46.61 177.8,53.21 165.23,54.48 158.37,56.77 154.05,56.9 149.73,57.02 149.73,61.21 136.02,61.47 139.95,61.47 145.54,61.47 160.4,64.9 170.56,70.48 174.88,69.98 174.5,63.75 170.69,63.75 180.09,78.74 193.29,76.07 192.66,83.82 192.79,91.06 192.66,94.87 180.34,87.88 170.81,88.65 165.86,83.69 162.18,85.98 158.5,85.98 162.05,77.34 156.84,77.85 165.86,77.47 170.81,77.6 146.69,78.61 147.32,83.57 135,71.25 106.55,72.9 114.43,72.52 113.92,67.69 107.31,67.94 135,84.71 128.65,83.82 101.35,90.42 94.74,90.3 106.81,88.65 109.98,90.17 106.55,85.47 93.6,85.47 76.2,81.41 109.6,32.26 128.27,47.5 139.83,47.62 150.37,41.4 141.1,35.31 133.98,22.35 134.87,17.53 62.36,41.4 59.44,40.01 57.28,43.56 54.74,42.55 51.31,44.83 26.67,42.16 12.19,42.8 11.68,50.55 71.76,38.61 31.12,15.24 47.12,20.19 70.61,21.34 51.05,19.81 43.05,72.14 51.18,72.01 130.43,42.16 114.55,42.42 106.05,51.05 101.6,58.04 116.46,51.05 113.28,54.1 108.46,51.31 114.05,58.17 126.87,58.93 133.1,56.64 103.63,24.64 112.01,37.85 115.19,22.23 115.19,26.67 9.14,31.24 3.94,22.73 13.08,21.72 25.78,20.7 39.37,32.64 51.05,49.91 46.86,49.66 69.47,53.72 71.25,49.28 55.63,50.42 51.43,30.1 51.43,34.8 102.36,51.31 100.2,16.26 51.56,38.61 117.73,72.52 119.89,91.69 114.81,16.26 122.68,16.64
  pour Top (isolate 0.61): 1.65,86.74 1.65,20.45 2.67,19.43 16.64,19.43 21.08,14.99 53.47,14.99 54.1,15.62 65.15,15.62 66.93,13.84 66.93,10.16 67.69,9.4 130.43,9.4 131.7,10.67 131.7,14.99 132.97,16.26 145.67,16.26 146.69,15.24 171.96,15.24 172.72,16 185.55,16 186.69,17.14 186.69,57.15 188.72,59.18 188.72,68.96 186.82,70.87 186.82,72.26 188.59,74.04 201.17,74.04 202.18,75.06 202.18,104.01 200.02,106.17 192.53,106.17 191.52,105.16 191.52,102.49 189.86,100.84 187.2,100.84 186.31,99.95 186.31,92.08 185.67,91.44 133.1,91.44 131.44,93.09 131.44,96.27 129.92,97.79 69.34,97.79 67.31,95.76 67.31,93.09 65.28,91.06 23.24,91.06 19.3,87.12 2.03,87.12
  pour Bottom (isolate 0.61): 1.65,86.74 1.65,20.45 2.67,19.43 16.64,19.43 21.08,14.99 53.47,14.99 54.1,15.62 65.15,15.62 66.93,13.84 66.93,10.16 67.69,9.4 130.43,9.4 131.7,10.67 131.7,14.99 132.97,16.26 145.67,16.26 146.69,15.24 171.96,15.24 172.72,16 185.55,16 186.69,17.14 186.69,57.15 188.72,59.18 188.72,68.96 186.82,70.87 186.82,72.26 188.59,74.04 201.17,74.04 202.18,75.06 202.18,104.01 200.02,106.17 192.53,106.17 191.52,105.16 191.52,102.49 189.86,100.84 187.2,100.84 186.31,99.95 186.31,92.08 185.67,91.44 133.1,91.44 131.44,93.09 131.44,96.27 129.92,97.79 69.34,97.79 67.31,95.76 67.31,93.09 65.28,91.06 23.24,91.06 19.3,87.12 2.03,87.12
GND_A
  Top 0.254: 175.13,98.3 173.1,99.95 | R8.2 172.85,93.6 X2.12 | R7.1 166.5,86.87 166.5,95 167.39,95.89 167.39,102.62 | 53.59,94.23 55.37,97.66 | 52.2,96.77 54.48,99.57
  Top 1.778: C4.- 6.22,92.58 | X3.12 53.59,94.23 X3.13 | X3.25 52.2,96.77 X3.24
  Top 1.93: 175.51,96.39 175.51,94.28 | 175.51,94.28 X2.13 174.57,95.22 X2.25 | 175.51,94.28 173.61,94.28 X2.12 173.18,95.02 X2.24
  Top 8: U$9.P$1 6.22,92.58 14.73,92.58 17.14,95 17.14,101.22 18.54,102.62 51.43,102.62 | 51.43,102.62 167.39,102.62 170.43,102.62 173.1,99.95 174.24,98.81 174.24,97.66 175.51,96.39 | 51.43,102.62 54.48,99.57 54.48,98.55 55.37,97.66 55.37,96.65 56.26,95.76
GNDP  (via drill 0.61)
  Top 0.254: 23.75,63.5 R6.1 | 21.97,56.13 21.97,52.7 22.35,52.32 22.35,32.38 17.78,27.81 17.78,19.05 22.73,14.1 22.73,12.83 X1.13 | R7.2 187.71,74.55 187.71,70.74 190.37,68.07 v190.37,64.64
  Top 0.305: 21.97,56.13 21.97,58.42 24,60.45 24,60.71 24.26,60.96 24.26,62.99 23.75,63.5
  Bottom 0.254: v190.37,64.64 195.2,59.82 195.2,16.13 195.07,16.13 193.55,12.45 | 190.25,11.56 191.45,10.35
  Bottom 1.27: 193.55,12.45 193.55,14.88 X5.24 | X5.25 193.29,13.39 193.29,16.13 192.53,16.13 192.02,15.62 191.64,15.62 191.13,15.11 190.12,15.11 189.36,14.35 189.43,14.28 X5.12 190.25,11.56 X5.13
  Bottom 1.778: X1.12 X1.13 24.18,11.46 X1.25 | X1.25 X1.24 | X1.25 23.5,10.29 20.96,7.75 | C7.- 9.65,6.99 7.11,4.45 | X4.12 X4.13 142.57,9.45 144.59,7.43 | X4.24 X4.25 143.94,8.97 144.27,8.64
  Bottom 8: 17.65,4.45 147.57,4.45 | 193.55,12.45 191.45,10.35 185.55,4.45 147.57,4.45 | U$8.P$1 7.11,4.45 17.65,4.45 | 17.65,4.45 20.96,7.75 23.37,10.16 | 147.57,4.45 144.59,7.43 144.27,7.75 144.27,8.64 144.27,9.14 142.62,10.79
MISO  (via drill 0.61)
  Top 0.254: SV16.5 149.48,71.63 v149.48,94.87 150.49,94.87 150.49,95.5 150.88,95.89 150.88,96.9 150.24,97.54 141.48,97.54 141.48,95.76 v139.7,93.98 | v92.84,9.27 92.84,56.52 92.96,56.64 92.96,63.37 U1.50 94.62,65.15 92.96,66.8 92.96,70.99 93.98,72.01 93.98,77.47 v100.33,83.82 105.54,89.03 105.54,92.71 105.66,92.84 105.66,95.89 106.93,97.16 v122.81,97.16 | v67.31,93.09 68.58,91.82 v78.23,91.82 | v160.53,21.59 158.62,19.68 v158.62,15.88
  Bottom 0.254: v149.48,94.87 149.61,95 163.7,95 164.85,93.85 X2.9 | 92.84,8.89 137.16,8.89 138.18,9.91 138.18,15.24 145.92,15.24 147.07,14.1 150.24,14.1 | 92.84,8.89 67.44,8.89 66.17,10.16 60.45,10.16 59.18,11.43 35.31,11.43 33.91,12.83 X1.9 | 150.24,14.1 151.26,14.1 152.4,12.95 X4.9 | 92.84,8.89 v92.84,9.27 | v67.31,93.09 46.48,93.09 45.34,94.23 X3.9 | v78.23,91.82 81.92,88.14 96.01,88.14 v100.33,83.82 | v160.53,21.59 189.36,21.59 190.25,22.48 X5.9 | v158.62,15.88 152.02,15.88 150.24,14.1 | v139.7,93.98 136.52,97.16 v122.81,97.16
MOSI  (via drill 0.61)
  Top 0.254: v35.56,87.76 35.56,86.23 31.5,82.17 v31.5,67.06 31.5,29.46 33.4,27.56 33.4,23.62 35.05,21.97 35.05,10.41 35.18,10.29 X1.21 | v39.37,91.57 43.81,91.57 43.81,96.77 X3.21 | v188.98,18.67 191.64,18.67 191.64,22.73 192.79,23.88 X5.21 | X4.21 155.07,10.41 155.19,10.54 v155.19,14.22 155.57,14.61 155.57,60.58 153.29,62.87 153.29,63.75 v150.62,66.42 | SV16.3 147.7,67.44 152.78,72.52 152.78,94.36 153.67,95.25 153.67,98.04 162.05,98.04 162.31,97.79 162.31,97.54 163.45,96.39 X2.21
  Bottom 0.254: v39.37,91.57 v35.56,87.76 | v155.19,14.22 155.57,14.61 184.91,14.61 v188.98,18.67 | v150.62,66.42 149.86,67.18 147.57,67.18 SV16.3 147.57,67.31 146.18,65.91 143.76,65.91 141.35,63.5 116.97,63.5 115.44,65.02 97.41,65.02 U1.51 97.16,65.15 96.01,66.29 93.73,66.29 92.96,67.06 v31.5,67.06
N$1
  Top 0.254: R9.1 129.54,57.28 126.24,57.28 125.35,56.39 U2.10
N$2  (via drill 0.61)
  Top 0.254: v128.91,38.35 128.91,37.59 U3.10
  Bottom 0.254: v128.91,38.35 129.67,37.59 R10.1
N$3
  Bottom 0.254: R11.1 68.45,45.09 64.14,45.09 64.01,45.21 U4.10
N$7
  Top 0.254: R5.1 LED2.A
N$8
  Bottom 0.254: R4.1 LED1.A
N$9
  Top 0.254: R4.2 U1.5V@0
N$15  (via drill 0.61)
  Top 0.254: U$7.P$2 U$7.P$1 | F3.2 100.84,67.44 v100.84,77.47
  Bottom 0.254: U$7.P$2 41.27,86.23 43.18,88.14 44.7,88.14 45.97,86.87 46.35,86.87 U$7.P$4 46.35,84.71 51.82,79.25 99.06,79.25 v100.84,77.47
N$16  (via drill 0.6)
  Top 0.813: 46.35,75.18 46.35,79.76 51.31,84.71 51.31,89.03 50.67,89.66
  Top 1.016: 46.35,75.18 46.35,55.88 v44.58,54.1
  Top 1.778: S6.2 S6.5
  Top 2.184: S6.5 25.15,83.06 26.16,84.07 26.16,88.01 27.81,89.66 50.67,89.66 76.2,89.66 | 76.84,89.03 U$7.P$7 U$7.P$8 | 46.35,75.18 U1.VIN | 76.2,89.66 76.84,89.03 | 76.2,89.66 76.84,89.66 76.84,89.03
  Bottom 1.016: v44.58,54.1 34.54,54.1 IC1.IN
N$25
  Top 0.254: R18.2 46.35,10.29 X1.17
N$26
  Top 0.254: R20.2 40.77,10.29 X1.19
N$27
  Top 0.254: R22.2 165.73,18.67 165.73,10.67 165.99,10.41 X4.17
N$28
  Top 0.254: R24.2 160.4,10.41 X4.19
N$31
  Top 0.254: R3.1 59.18,83.69 59.18,85.34 57.4,87.12 R2.1
  Bottom 0.254: U$7.P$10 84.45,84.33 84.07,84.33 82.8,83.06 69.09,83.06 67.56,84.58 R1.1 67.56,84.45 60.2,84.45 R2.1
PB1  (via drill 0.61)
  Top 0.254: U1.3 53.21,30.48 v53.21,70.99 | v153.67,78.99 153.67,93.73 153.8,93.85 X2.5
  Bottom 0.254: v53.21,70.99 54.36,72.14 91.19,72.14 95.63,76.58 148.21,76.58 150.62,78.99 v153.67,78.99
PB2  (via drill 0.61)
  Top 0.254: v67.82,48.01 67.44,47.62 67.44,26.04 v67.82,25.65
  Bottom 0.254: v67.82,48.01 67.31,47.5 64.77,47.5 64.64,47.37 64.01,47.37 U4.7 | v67.82,25.65 67.44,25.27 41.53,25.27 39.88,26.92 U1.9
PB2_5V
  Bottom 0.254: 43.43,46.61 43.81,46.99 57.4,46.99 57.66,47.24 58.17,47.24 U4.14 | 7.24,46.61 5.33,48.51 SV12.1
  Bottom 0.305: 43.43,46.61 43.43,45.85 41.66,44.07 9.52,44.07 7.24,46.35 7.24,46.61
PB3  (via drill 0.61)
  Top 0.254: U1.11 32,29.84 32,66.29 32.38,66.67 32.38,73.41 32,73.79 32,81.41 v32.89,82.3
  Bottom 0.254: v32.89,82.3 32.89,94.23 X3.5
PB4
  Top 0.254: U1.13 29.72,26.92 32.38,24.26 32.38,12.7 33.65,11.43 33.65,9.14 43.94,9.14 44.7,9.91 44.7,12.7 44.83,12.83 X1.5
PB5  (via drill 0.61)
  Top 0.254: U1.7 46.86,26.67 46.86,25.53 46.99,25.4 46.99,24 v48.13,22.86 | v85.73,23.37 v79.76,23.37 | v163.83,17.27 164.59,16.51 164.59,12.95 X4.5
  Bottom 0.254: v48.13,22.86 53.21,22.86 54.1,23.75 79.38,23.75 v79.76,23.37 | v85.73,23.37 87.76,21.34 105.03,21.34 106.05,20.32 139.19,20.32 139.32,20.19 153.92,20.19 154.3,19.81 158.75,19.81 159.13,20.19 160.91,20.19 v163.83,17.27
PB6  (via drill 0.61)
  Top 0.254: U1.5 53.09,25.53 53.09,18.54 56.52,15.11 59.31,15.11 59.31,14.86 v62.23,11.94 | v143.26,21.08 v136.4,14.22
  Bottom 0.254: v62.23,11.94 66.55,11.94 67.31,11.18 67.44,11.18 68.07,10.54 92.08,10.54 92.2,10.67 94.11,10.67 94.74,10.03 132.21,10.03 v136.4,14.22 | v143.26,21.08 145.54,23.37 158.75,23.37 159,23.11 186.44,23.11 190.25,26.92 190.75,26.92 191.39,27.56 191.39,33.27 190.5,33.27 190.25,33.53 X5.5
PT1  (via drill 0.61)
  Top 0.254: v76.58,31.88 76.58,73.15 75.82,73.91 75.82,75.82 v82.17,82.17 | v157.48,90.3 159.38,92.2 X2.7
  Bottom 0.254: U1.2 64.01,31.88 v76.58,31.88 | v82.17,82.17 82.55,82.55 91.44,82.55 91.69,82.8 109.73,82.8 110.62,81.92 122.56,81.92 132.72,92.08 136.02,92.08 137.79,90.3 v157.48,90.3
PT2
  Bottom 0.254: U1.8 42.54,27.05 48.77,33.27 56.39,33.27 56.39,41.02 62.74,47.37 62.86,47.37 63.37,47.88 63.88,47.88 U4.6
PT2_5V
  Bottom 0.254: 43.69,48.01 58.17,48.01 U4.15 | 9.27,47.12 5.33,51.05 SV12.2
  Bottom 0.305: 9.27,47.12 11.3,45.09 16.64,45.09 16.89,45.34 41.27,45.34 42.54,46.61 42.54,47.12 43.43,48.01 43.69,48.01
PT3  (via drill 0.61)
  Top 0.254: U1.10 37.97,27.69 37.97,44.58 40.64,47.24 v40.64,47.5 | 36.58,58.67 36.58,69.98 32.51,74.04 32.51,80.64 36.07,84.2 36.07,87 v36.83,87.76
  Top 0.305: 36.58,58.67 36.58,57.66 38.1,57.66 40.26,55.5 40.26,51.69 41.78,50.16 41.78,48.64 v40.64,47.5
  Bottom 0.254: v36.83,87.76 40.26,91.19 40.26,94.23 X3.7
PT4  (via drill 0.61)
  Top 0.254: X1.7 36.45,15.75 v36.45,23.11
  Bottom 0.254: v36.45,23.11 33.78,25.78 33.4,25.78 32.26,26.92 U1.12
PT5  (via drill 0.61)
  Top 0.254: U1.6 50.04,26.04 v50.04,21.97 | v64.39,11.05 v60.2,15.24 | v136.78,9.78 143,9.78 143.51,9.27 159.13,9.27 X4.7
  Bottom 0.254: v50.04,21.97 54.36,21.97 54.86,21.46 54.86,14.99 59.94,14.99 v60.2,15.24 | v64.39,11.05 64.77,10.67 67.18,10.67 67.82,10.03 92.33,10.03 92.46,10.16 93.22,10.16 93.98,9.4 136.4,9.4 v136.78,9.78
PT6  (via drill 0.61)
  Top 0.254: U1.4 54.48,26.67 v54.48,22.86 | v74.93,20.83 v72.9,22.86 | v116.97,21.72 v112.4,17.14
  Bottom 0.254: v72.9,22.86 v54.48,22.86 | v74.93,20.83 78.61,17.14 v112.4,17.14 | v116.97,21.72 120.27,25.02 187.2,25.02 X5.7
RESET  (via drill 0.61)
  Top 0.254: v110.62,83.19 109.09,83.19 S2.2 S2.1 100.97,83.06 v96.27,78.36
  Bottom 0.254: v110.62,83.19 C2.2 | U1.RESET 36.2,77.72 41.66,77.72 42.29,78.36 v96.27,78.36
RX0  (via drill 0.61)
  Top 0.254: v124.21,56.77 124.21,56.26 124.71,55.75 124.71,55.63 125.22,55.63 U2.9 | 103.38,52.83 v106.93,56.39 | v64.39,35.05 64.26,34.92 U1.0
  Top 0.305: 103.38,52.83 103.38,44.96 102.74,44.96 v102.74,44.58
  Bottom 0.254: v124.21,56.77 123.83,56.39 v106.93,56.39 | v102.74,44.58 102.49,44.32 99.19,44.32 98.3,43.43 91.69,43.43 83.31,35.05 v64.39,35.05
RX0_5V  (via drill 0.61)
  Top 0.254: v120.4,58.17 120.4,56.01 120.14,55.75 120.14,55.63 119.63,55.63 U2.12 | v132.72,60.83 141.48,69.6 v141.48,71.12
  Bottom 0.254: v120.4,58.17 123.06,60.83 v132.72,60.83 | v141.48,71.12 144.53,74.17 177.67,74.17 183.01,68.83 X7.1
RX1  (via drill 0.61)
  Top 0.254: v78.23,48.64 82.04,44.83 U1.19
  Bottom 0.254: v78.23,48.64 75.82,51.05 65.53,51.05 65.15,51.44 64.14,51.44 64.01,51.31 U4.1
RX1_5V  (via drill 0.61)
  Top 0.254: v61.34,51.44 62.74,52.83 v62.74,62.48 | v78.99,66.17 85.98,73.15 85.98,75.82 v92.08,81.92
  Bottom 0.254: v61.34,51.44 58.42,51.44 58.29,51.31 U4.20 | v62.74,62.48 63.75,63.5 76.33,63.5 v78.99,66.17 | v92.08,81.92 92.33,81.66 110.11,81.66 110.49,81.28 153.54,81.28 154.18,81.92 183.9,81.92 187.07,78.74 SV11.2
RX2  (via drill 0.61)
  Top 0.254: v62.74,48.51 65.28,45.97 v65.28,30.99
  Bottom 0.254: v62.74,48.51 63.37,49.15 63.88,49.15 U4.4 | v65.28,30.99 66.93,29.34 74.55,29.34 76.84,27.05 U1.17
RX2_5V  (via drill 0.61)
  Top 0.254: v59.44,49.02 58.55,49.91 58.55,52.7 v59.05,53.21 | v78.99,55.24 92.46,68.71 92.46,73.03 93.47,74.04 93.47,78.23 105.03,89.79 105.03,96.01 107.19,98.17 137.92,98.17 v137.92,92.2
  Bottom 0.254: v59.44,49.02 58.93,49.02 58.8,49.15 58.29,49.15 U4.17 | v59.05,53.21 61.09,55.24 v78.99,55.24 | v137.92,92.2 138.05,92.08 141.6,92.08 141.86,91.82 147.95,91.82 148.34,92.2 160.15,92.2 160.53,92.58 197.48,92.58 197.99,92.08 198.5,92.08 198.63,91.95 SV10.2
RX3  (via drill 0.61)
  Top 0.254: v127.38,54.61 126.11,54.61 125.86,54.36 125.35,54.36 U2.7 | U1.15 73.91,29.08 v73.91,42.04
  Bottom 0.254: SV23.2 164.34,63.5 160.27,59.44 139.83,59.44 135.25,54.86 127.64,54.86 v127.38,54.61 127.38,54.74 127.25,54.74 126.62,55.37 121.41,55.37 121.03,54.99 116.2,54.99 114.05,52.83 102.62,52.83 98.55,48.77 93.73,48.77 88.39,43.43 75.31,43.43 v73.91,42.04
RX3_5V  (via drill 0.61)
  Top 0.254: v121.29,57.28 121.29,55.37 120.4,54.48 120.4,54.36 119.63,54.36 U2.14
  Bottom 0.254: v121.29,57.28 123.95,59.94 151.51,59.94 156.34,64.77 SV1.2
SCK  (via drill 0.61)
  Top 0.254: 149.29,66.36 160.53,77.6 160.53,94.61 159.64,95.5 159.64,96.9 160.27,97.54 161.8,97.54 161.8,96.9 162.43,96.27 162.43,95.89 163.07,95.25 165.99,95.25 165.99,96.14 166.24,96.39 X2.22 | 149.29,66.36 SV16.1 | X4.22 152.27,10.41 152.53,10.67 152.53,13.84 154.69,16 v154.69,20.7 154.69,49.91 152.78,51.82 152.78,62.99 151.38,64.39 151.38,64.9 150.75,64.9 149.29,66.36 | X1.22 30.86,10.29 30.86,10.79 29.97,11.68 20.45,11.68 20.45,14.86 15.62,19.68 15.62,54.99 v22.86,62.23 | v29.85,69.22 30.61,69.98 v30.61,74.68 | v45.34,92.71 46.35,93.73 46.35,96.52 46.61,96.77 X3.22 | v98.55,64.14 98.43,64.26 98.43,65.66 97.79,66.29 95.89,66.29 95.89,66.42 94.74,67.56 U1.52
  Bottom 0.254: v154.69,20.7 167.26,20.7 172.59,15.37 184.15,15.37 189.86,21.08 192.79,21.08 X5.22 | v22.86,62.23 v29.85,69.22 29.85,69.09 30.99,67.94 94.49,67.94 U1.52 | v45.34,92.71 42.54,92.71 40.13,90.3 40.13,83.57 38.23,81.66 37.34,81.66 34.54,78.87 32.77,78.87 32,78.11 32,76.07 v30.61,74.68 | SV16.1 145.92,62.99 99.7,62.99 v98.55,64.14
SCL  (via drill 0.61)
  Top 0.254: v49.4,91.57 X3.23 | v51.56,80.77 51.18,80.39 51.18,77.47 49.15,75.44 49.15,29.72 47.88,28.45 v47.88,24.38 | v130.43,52.96 128.4,52.96 128.27,53.09 125.35,53.09 U2.5 | v156.46,50.93 158.37,49.02 158.37,46.74 160.27,44.83 SV22.3 | X4.23 147.83,10.41 147.83,11.56 146.49,12.89 | 146.49,12.89 146.43,12.95 146.43,14.73 144.14,17.02 v144.14,52.7 | X2.23 168.78,96.14 v168.78,60.45 | U1.21 87.5,26.67 v87.5,23.24 | v127.25,21.21 136.65,11.81 146.43,11.81 146.43,12.83 146.49,12.89
  Bottom 0.254: 29.72,14.86 X1.23 | 37.21,21.59 45.59,21.59 48.2,24.19 | 48.2,24.19 48.77,24.77 78.87,24.77 80.65,26.54 80.65,28.83 85.22,28.83 87,27.05 U1.21 | v47.88,24.38 48.01,24.26 48.13,24.26 48.2,24.19 | v130.43,52.96 131.06,52.32 144.14,52.32 | 144.14,52.32 155.07,52.32 v156.46,50.93 156.46,51.05 159.38,51.05 v168.78,60.45 | 144.14,52.32 v144.14,52.7 | X5.23 194.44,20.07 194.44,42.16 191.52,42.16 190.25,43.43 163.19,43.43 161.8,44.83 SV22.3 | v87.5,23.24 88.9,21.84 105.28,21.84 106.17,20.95 114.17,20.95 114.3,20.83 126.87,20.83 v127.25,21.21 | v49.4,91.57 53.85,87.12 53.85,81.79 52.83,80.77 v51.56,80.77
  Bottom 0.305: 29.72,14.86 29.72,15.62 30.35,16.26 31.88,16.26 37.21,21.59
SCL_1  (via drill 0.61)
  Top 0.254: 22.86,30.35 22.54,30.04 U1.SCL1 | v80.52,66.17 88.52,74.17 88.52,75.82 v92.84,80.14 | v144.14,77.47 145.16,76.45 SV16.8
  Top 0.305: v24,58.55 24,30.35 23.69,30.04 22.54,30.04
  Bottom 0.254: 28.7,61.59 75.95,61.59 v80.52,66.17 | v92.84,80.14 93.22,79.76 121.03,79.76 123.32,77.47 v144.14,77.47
  Bottom 0.305: v24,58.55 27.05,61.59 28.7,61.59
SCL_5V  (via drill 0.61)
  Top 0.254: v118.24,53.59 118.62,53.21 118.62,53.09 119.51,53.09 U2.16 | v123.32,53.47 123.32,63.37 IC2.6
  Bottom 0.254: v118.24,53.59 118.36,53.47 v123.32,53.47
SCL_5V_A  (via drill 0.61)
  Top 0.254: v151.13,49.15 148.72,46.74 148.72,46.23 147.32,44.83 SV14.3 | IC2.7 131.32,68.33 131.32,47.88 v134.37,44.83
  Bottom 0.254: X7.4 189.36,61.72 189.36,58.29 188.59,58.29 179.45,49.15 v151.13,49.15 | SV14.3 v134.37,44.83
SDA  (via drill 0.61)
  Top 0.254: v48.13,91.57 48.13,94.23 X3.10 | v50.67,81.66 48.64,79.63 48.64,31.75 44.58,27.69 v44.58,14.35 | v129.41,49.66 126.62,52.45 125.35,52.45 U2.4 125.22,52.45 124.71,52.45 123.83,51.56 123.83,46.61 v122.43,45.21 | X2.10 167.77,93.85 167.77,48.51 161.54,42.29 SV22.2 160.02,42.29 157.73,40.01 v157.73,13.72 | v97.79,25.02 100.84,28.07 v100.84,43.43
  Bottom 0.254: X1.10 31.12,12.83 32.64,14.35 v44.58,14.35 65.66,14.35 73.79,22.48 80.14,22.48 84.58,26.92 U1.20 84.45,26.67 85.98,25.15 93.34,25.15 93.47,25.02 v97.79,25.02 | v48.13,91.57 53.09,86.61 53.09,82.68 52.07,81.66 v50.67,81.66 | 157.73,11.81 183.39,11.81 190.25,18.67 X5.10 | 157.73,11.81 152.02,11.81 150.88,12.95 X4.10 | v129.41,49.66 149.1,49.66 156.46,42.29 SV22.2 | v157.73,13.72 157.73,11.81 | v100.84,43.43 101.09,43.69 116.2,43.69 117.09,44.58 121.79,44.58 v122.43,45.21
SDA_1  (via drill 0.61)
  Top 0.254: v128.52,29.21 137.79,38.48 137.79,64.39 v141.48,68.07
  Bottom 0.254: U1.SDA1 23.88,28.83 39.75,28.83 41.27,27.3 41.27,26.42 41.4,26.42 41.91,25.91 42.93,25.91 49.78,32.77 86.49,32.77 93.73,25.53 96.9,25.53 97.28,25.91 98.68,25.91 101.47,28.7 120.02,28.7 120.52,29.21 v128.52,29.21 | v141.48,68.07 143.26,69.85 SV16.6
SDA_5V  (via drill 0.61)
  Top 0.254: v117.35,64.39 117.35,52.45 119.51,52.45 U2.17
  Bottom 0.254: v117.35,64.39 117.6,64.14 125.86,64.14 127.76,66.04 IC2.5
SDA_5V_A  (via drill 0.61)
  Top 0.254: v180.47,63.25 X7.3 | v153.29,50.04 149.22,45.97 149.22,44.2 147.32,42.29 SV14.2 | IC2.4 122.17,64.77 122.17,54.86 v121.79,54.48
  Bottom 0.254: v180.47,63.25 176.53,63.25 163.32,50.04 v153.29,50.04 151.51,51.82 128.4,51.82 125.86,54.36 121.92,54.36 v121.79,54.48
TX0  (via drill 0.61)
  Top 0.254: v122.43,46.48 122.94,46.99 122.94,51.82 124.21,53.09 124.21,54.36 124.71,54.86 125.22,54.86 U2.8 | v99.31,45.21 97.54,43.43 96.65,43.43 96.65,43.31 95.89,42.55 95.89,41.78 95.25,41.15 v93.73,41.15 | v63.37,34.16 61.72,32.51 U1.1
  Bottom 0.254: v122.43,46.48 122.3,46.35 100.46,46.35 v99.31,45.21 | v93.73,41.15 86.74,34.16 v63.37,34.16
TX0_5V  (via drill 0.61)
  Top 0.254: v122.17,79.88 119,76.71 119,64.77 117.98,63.75 117.98,55.12 118.24,54.86 119.51,54.86 U2.13 | v175.01,79.88 186.05,68.83 X7.2
  Bottom 0.254: v175.01,79.88 v122.17,79.88
TX1  (via drill 0.61)
  Top 0.254: 70.99,46.1 v67.82,49.28
  Top 0.305: 70.99,46.1 70.87,45.97 70.87,39.37 70.61,39.12 70.61,38.1 70.99,37.72 v70.99,30.99
  Bottom 0.254: v67.82,49.28 65.41,49.28 65.15,49.53 64.9,49.53 64.64,49.78 64.01,49.78 U4.3 | v70.99,30.99 72.14,29.84 76.58,29.84 79.38,27.05 U1.18
TX1_5V  (via drill 0.61)
  Top 0.254: v59.44,50.29 59.94,50.8 59.94,67.44 v61.34,68.83
  Bottom 0.254: v59.44,50.29 59.05,50.29 58.8,50.04 58.42,50.04 58.29,49.91 U4.18 | v61.34,68.83 95.25,68.83 95.38,68.71 96.65,68.71 96.77,68.83 97.79,68.83 97.92,68.71 98.3,68.71 99.44,69.85 122.17,69.85 127.38,75.06 188.34,75.06 189.61,73.79 189.99,73.79 190.37,73.41 197.23,73.41 200.02,76.2 SV11.1
TX2  (via drill 0.61)
  Top 0.254: v65.28,48.39 66.17,47.5 66.17,29.08 v66.04,28.96
  Bottom 0.254: v65.28,48.39 65.15,48.39 65.02,48.51 64.01,48.51 U4.5 | v66.04,28.96 66.17,28.83 72.52,28.83 74.3,27.05 U1.16
TX2_5V  (via drill 0.61)
  Top 0.254: v56.9,49.02 57.28,49.4 57.28,70.87 60.58,74.17 60.58,75.82 64.64,79.88 69.85,79.88 v69.85,83.95
  Bottom 0.254: v56.9,49.02 57.15,49.02 57.53,48.64 58.17,48.64 U4.16 | v69.85,83.95 72.52,86.61 72.52,92.08 74.8,92.08 75.82,93.09 75.82,97.16 100.97,97.16 110.74,87.38 127.25,87.38 132.46,92.58 136.27,92.58 138.05,90.81 147.7,90.81 148.59,91.69 160.4,91.69 160.78,92.08 185.55,92.08 188.21,89.41 SV10.1
TX3  (via drill 0.61)
  Top 0.254: U2.6 125.35,53.72 128.78,53.72 v128.78,53.85 128.78,54.48 v127.38,55.88 | U1.14 73.03,30.73 73.03,52.32 v73.91,53.21
  Bottom 0.254: v128.78,53.85 129.29,54.36 161.92,54.36 167.77,60.2 167.77,65.53 166.62,65.53 166.12,66.04 SV23.3 | v73.91,53.21 74.55,53.85 99.82,53.85 101.47,55.5 120.78,55.5 121.16,55.88 v127.38,55.88
TX3_5V  (via drill 0.61)
  Top 0.254: v121.54,52.58 121.54,53.59 119.63,53.59 U2.15 | v147.57,50.93 151.76,55.12 v151.76,62.74
  Bottom 0.254: v121.54,52.58 123.19,50.93 v147.57,50.93 | v151.76,62.74 156.34,67.31 SV1.3

## Text on the board
Top: msi
Bottom: msi
tPlace: 24v | 3.3v | ANALOG | DIGITAL | 5 G | A13 | A11 | A10 | A14 | tx2 rx2 G 5v | 5V 30 G | 3.3v | G | 3.3v | G | 3.3v | G | 3.3v | G | 5V 32 G | 5V 28 G | G_P | G R3 T3 5 | IITB ROVER TEAM / Raunak | tx1 rx1 G 5v | DUO RESET / SWITCH | convert it to 5v | 12v G | uart 3 | to tegra | G rx tx 5V | logic converted | G rx tx 3.3V | 9 8 G 5v | logic not converted | logic converted | logic not converted | 49 48 G 5v | I2C | ENCODER SWITCH | G sda scl 5v | 3.3v scl sda G | TOP | A5 | A4 | A9 | A8 | 5V 22 G | 5V 26 G | 24V | G A 5V | 3.3v | 3.3v | 3.3v | 3.3v | G | G | G | G | 5V 24 G | ANALOG | DIGITAL | G_P
bPlace: IITB ROVER TEAM / Raunak | 5V G 12V